# Altium schematic sheet Block_Diagram.SchDoc: B153AA Block Diagram
size 292 x 193 mm; SheetNumber: 1; SheetTotal: 6
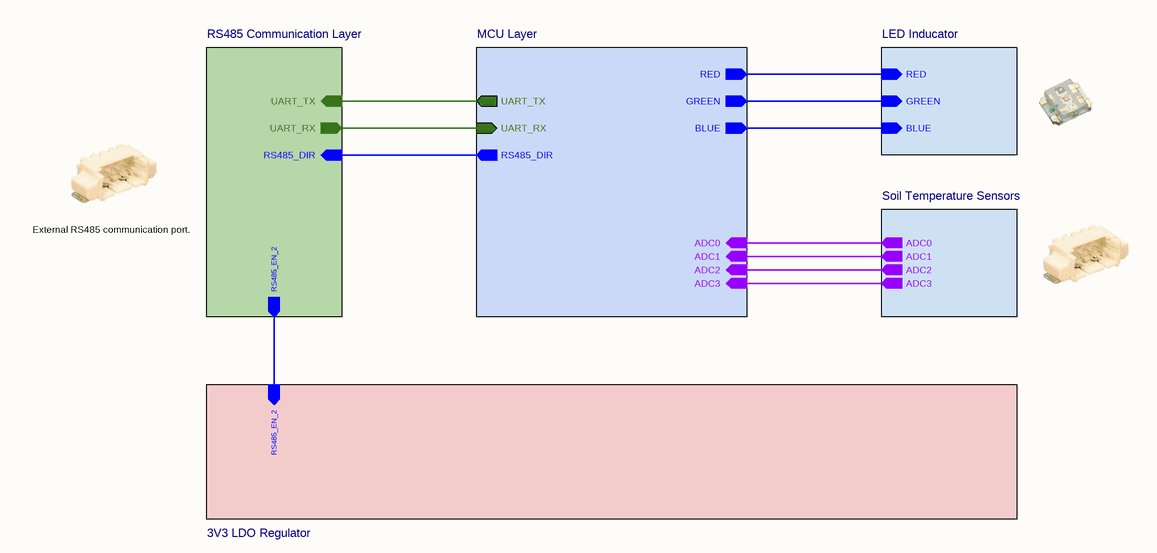
[diagram p0: Block_Diagram.SchDoc]

## Sub-sheets
3V3 LDO Regulator = 3V3 LDO Regulator.SchDoc: RS485_EN_2 (in)
LED Inducator = LED Inducator.SchDoc: RED (in), BLUE (in), GREEN (in)
MCU Layer = MicroController.SchDoc: UART_TX (out), UART_RX (in), RS485_DIR (out), GREEN (out), RED (out), BLUE (out), ADC1 (in), ADC0 (in), ADC2 (in), ADC3 (in)
RS485 Communication Layer = RS485 Communication Layer.SchDoc: RS485_DIR (in), UART_RX (out), UART_TX (in), RS485_EN_2 (out)
Soil Temperature Sensors = Soil Temperature Sensors.SchDoc: ADC0 (out), ADC1 (out), ADC3 (out), ADC2 (out)

## Nets
(unnamed): sheet RS485 Communication Layer/RS485_DIR, sheet MCU Layer/RS485_DIR
(unnamed): sheet RS485 Communication Layer/UART_RX, sheet MCU Layer/UART_RX
(unnamed): sheet RS485 Communication Layer/UART_TX, sheet MCU Layer/UART_TX
(unnamed): sheet RS485 Communication Layer/RS485_EN_2, sheet 3V3 LDO Regulator/RS485_EN_2
(unnamed): sheet MCU Layer/GREEN, sheet LED Inducator/GREEN
(unnamed): sheet MCU Layer/RED, sheet LED Inducator/RED
(unnamed): sheet MCU Layer/BLUE, sheet LED Inducator/BLUE
(unnamed): sheet MCU Layer/ADC1, sheet Soil Temperature Sensors/ADC1
(unnamed): sheet MCU Layer/ADC0, sheet Soil Temperature Sensors/ADC0
(unnamed): sheet MCU Layer/ADC2, sheet Soil Temperature Sensors/ADC2
(unnamed): sheet MCU Layer/ADC3, sheet Soil Temperature Sensors/ADC3

## Notes on the sheet
- External RS485 communication port.
- © 2021 All rights reserved.
  This document may not, in whole or in part, be copied, photocopied, reproduced, translated or converted to any electronic or machine readable from without prior written permission of Mehmet Günce Akkoyun.
  Engineer contact : akkoyun@me.com
- Property of
- Engineer :
- Date :
- Size :
- A4
- Time :
- Project :
- Page :
- /
- Customer :
- Product ID :
- Module ID :
- Version :
- File :
- Revision :